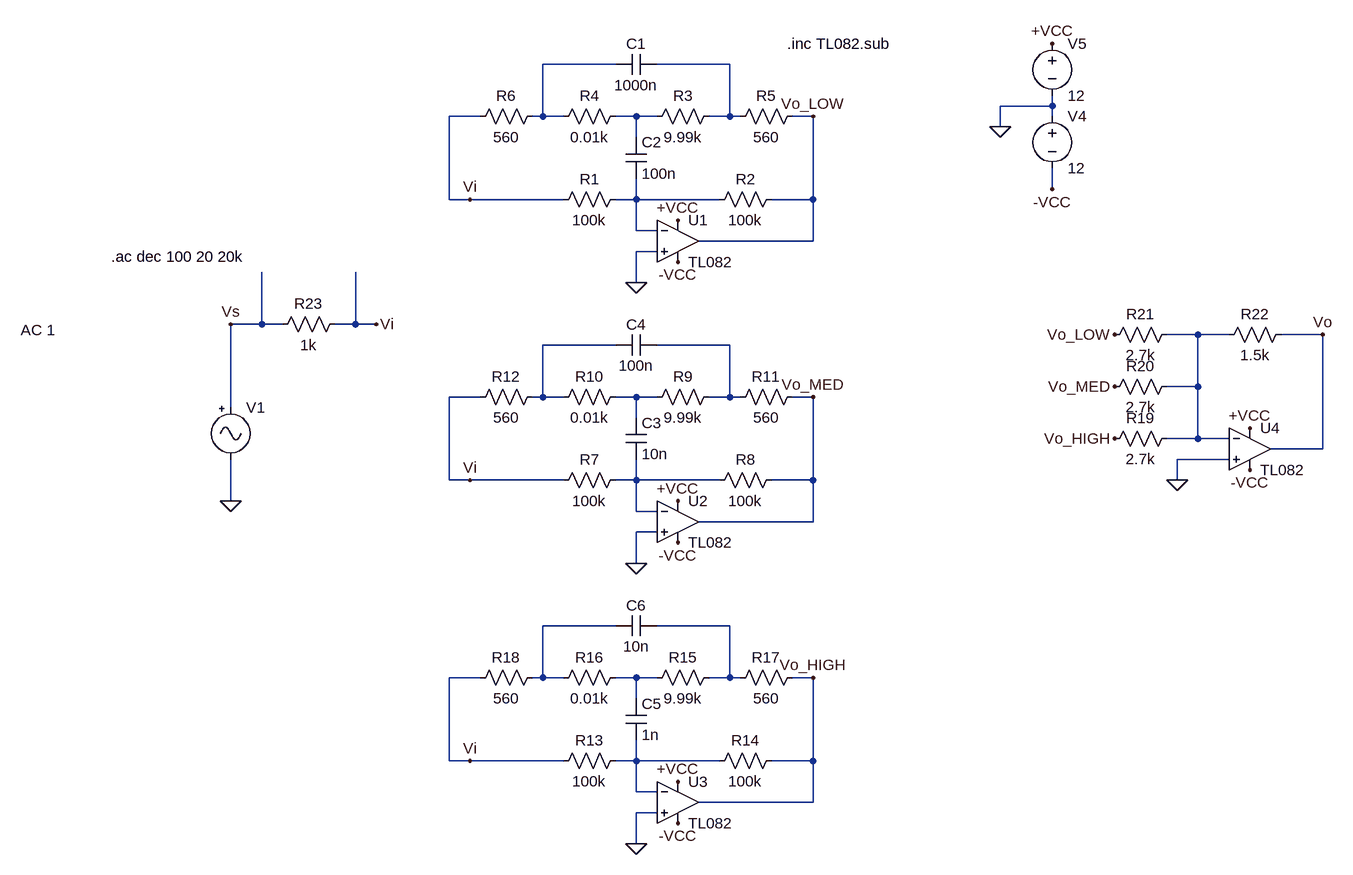
[diagram p0: schematic Ecualizador.asc]
Ecualizador.asc, the LTspice schematic file:
Version 4
SHEET 1 1656 1228
WIRE 80 -64 -32 -64
WIRE 256 -64 144 -64
WIRE 752 0 752 -16
WIRE 752 0 672 0
WIRE -128 16 -176 16
WIRE -32 16 -32 -64
WIRE -32 16 -48 16
WIRE 0 16 -32 16
WIRE 112 16 80 16
WIRE 144 16 112 16
WIRE 256 16 256 -64
WIRE 256 16 224 16
WIRE 272 16 256 16
WIRE 384 16 352 16
WIRE 752 16 752 0
WIRE 672 32 672 0
WIRE 112 48 112 16
WIRE 752 128 752 96
WIRE -176 144 -176 16
WIRE -144 144 -176 144
WIRE 0 144 -144 144
WIRE 112 144 112 112
WIRE 112 144 80 144
WIRE 240 144 112 144
WIRE 384 144 384 16
WIRE 384 144 320 144
WIRE 112 192 112 144
WIRE 144 192 112 192
WIRE 384 208 384 144
WIRE 384 208 208 208
WIRE 144 224 112 224
WIRE 112 272 112 224
WIRE -464 336 -464 256
WIRE -464 336 -512 336
WIRE -432 336 -464 336
WIRE -320 336 -320 256
WIRE -320 336 -352 336
WIRE -288 336 -320 336
WIRE 976 352 928 352
WIRE 1024 352 976 352
WIRE 1168 352 1104 352
WIRE 80 368 -32 368
WIRE 256 368 144 368
WIRE 976 432 976 352
WIRE 976 432 928 432
WIRE -128 448 -176 448
WIRE -32 448 -32 368
WIRE -32 448 -48 448
WIRE 0 448 -32 448
WIRE 112 448 80 448
WIRE 144 448 112 448
WIRE 256 448 256 368
WIRE 256 448 224 448
WIRE 272 448 256 448
WIRE 384 448 352 448
WIRE -512 464 -512 336
WIRE 112 480 112 448
WIRE 976 512 976 432
WIRE 976 512 928 512
WIRE 1024 512 976 512
WIRE 1168 528 1168 352
WIRE 1168 528 1088 528
WIRE 1024 544 944 544
WIRE -176 576 -176 448
WIRE -144 576 -176 576
WIRE 0 576 -144 576
WIRE 112 576 112 544
WIRE 112 576 80 576
WIRE 240 576 112 576
WIRE 384 576 384 448
WIRE 384 576 320 576
WIRE 944 576 944 544
WIRE -512 608 -512 544
WIRE 112 624 112 576
WIRE 144 624 112 624
WIRE 384 640 384 576
WIRE 384 640 208 640
WIRE 144 656 112 656
WIRE 112 704 112 656
WIRE 80 800 -32 800
WIRE 256 800 144 800
WIRE -128 880 -176 880
WIRE -32 880 -32 800
WIRE -32 880 -48 880
WIRE 0 880 -32 880
WIRE 112 880 80 880
WIRE 144 880 112 880
WIRE 256 880 256 800
WIRE 256 880 224 880
WIRE 272 880 256 880
WIRE 384 880 352 880
WIRE 112 912 112 880
WIRE -176 1008 -176 880
WIRE -144 1008 -176 1008
WIRE 0 1008 -144 1008
WIRE 112 1008 112 976
WIRE 112 1008 80 1008
WIRE 240 1008 112 1008
WIRE 384 1008 384 880
WIRE 384 1008 320 1008
WIRE 112 1056 112 1008
WIRE 144 1056 112 1056
WIRE 384 1072 384 1008
WIRE 384 1072 208 1072
WIRE 144 1088 112 1088
WIRE 112 1136 112 1088
FLAG 112 272 0
FLAG 112 704 0
FLAG 112 1136 0
FLAG 672 32 0
FLAG 752 -96 +VCC
FLAG 176 176 +VCC
FLAG 176 608 +VCC
FLAG 176 1040 +VCC
FLAG 752 128 -VCC
FLAG 176 240 -VCC
FLAG 176 672 -VCC
FLAG 176 1104 -VCC
FLAG 384 16 Vo_LOW
FLAG 384 448 Vo_MED
FLAG 384 880 Vo_HIGH
FLAG 1056 496 +VCC
FLAG 1056 560 -VCC
FLAG 848 352 Vo_LOW
FLAG 848 432 Vo_MED
FLAG 848 512 Vo_HIGH
FLAG 1168 352 Vo
FLAG 944 576 0
FLAG -512 608 0
FLAG -144 144 Vi
FLAG -144 576 Vi
FLAG -144 1008 Vi
FLAG -288 336 Vi
FLAG -512 336 Vs
SYMBOL res 96 128 R90
WINDOW 0 0 56 VBottom 2
WINDOW 3 32 56 VTop 2
SYMATTR InstName R1
SYMATTR Value 100k
SYMBOL res 336 128 R90
WINDOW 0 0 56 VBottom 2
WINDOW 3 32 56 VTop 2
SYMATTR InstName R2
SYMATTR Value 100k
SYMBOL cap 96 48 R0
SYMATTR InstName C2
SYMATTR Value 100n
SYMBOL res 240 0 R90
WINDOW 0 0 56 VBottom 2
WINDOW 3 32 56 VTop 2
SYMATTR InstName R3
SYMATTR Value 9.99k
SYMBOL res 96 0 R90
WINDOW 0 0 56 VBottom 2
WINDOW 3 32 56 VTop 2
SYMATTR InstName R4
SYMATTR Value 0.01k
SYMBOL res 368 0 R90
WINDOW 0 0 56 VBottom 2
WINDOW 3 32 56 VTop 2
SYMATTR InstName R5
SYMATTR Value 560
SYMBOL res -32 0 R90
WINDOW 0 0 56 VBottom 2
WINDOW 3 32 56 VTop 2
SYMATTR InstName R6
SYMATTR Value 560
SYMBOL Misc\\signal -512 448 R0
WINDOW 123 -323 -103 Left 2
WINDOW 39 0 0 Left 2
SYMATTR Value2 AC 1
SYMATTR InstName V1
SYMATTR Value ""
SYMBOL cap 144 -80 R90
WINDOW 0 0 32 VBottom 2
WINDOW 3 32 32 VTop 2
SYMATTR InstName C1
SYMATTR Value 1000n
SYMBOL res 96 560 R90
WINDOW 0 0 56 VBottom 2
WINDOW 3 32 56 VTop 2
SYMATTR InstName R7
SYMATTR Value 100k
SYMBOL res 336 560 R90
WINDOW 0 0 56 VBottom 2
WINDOW 3 32 56 VTop 2
SYMATTR InstName R8
SYMATTR Value 100k
SYMBOL cap 96 480 R0
SYMATTR InstName C3
SYMATTR Value 10n
SYMBOL res 240 432 R90
WINDOW 0 0 56 VBottom 2
WINDOW 3 32 56 VTop 2
SYMATTR InstName R9
SYMATTR Value 9.99k
SYMBOL res 96 432 R90
WINDOW 0 0 56 VBottom 2
WINDOW 3 32 56 VTop 2
SYMATTR InstName R10
SYMATTR Value 0.01k
SYMBOL res 368 432 R90
WINDOW 0 0 56 VBottom 2
WINDOW 3 32 56 VTop 2
SYMATTR InstName R11
SYMATTR Value 560
SYMBOL res -32 432 R90
WINDOW 0 0 56 VBottom 2
WINDOW 3 32 56 VTop 2
SYMATTR InstName R12
SYMATTR Value 560
SYMBOL cap 144 352 R90
WINDOW 0 0 32 VBottom 2
WINDOW 3 32 32 VTop 2
SYMATTR InstName C4
SYMATTR Value 100n
SYMBOL res 96 992 R90
WINDOW 0 0 56 VBottom 2
WINDOW 3 32 56 VTop 2
SYMATTR InstName R13
SYMATTR Value 100k
SYMBOL res 336 992 R90
WINDOW 0 0 56 VBottom 2
WINDOW 3 32 56 VTop 2
SYMATTR InstName R14
SYMATTR Value 100k
SYMBOL cap 96 912 R0
SYMATTR InstName C5
SYMATTR Value 1n
SYMBOL res 240 864 R90
WINDOW 0 0 56 VBottom 2
WINDOW 3 32 56 VTop 2
SYMATTR InstName R15
SYMATTR Value 9.99k
SYMBOL res 96 864 R90
WINDOW 0 0 56 VBottom 2
WINDOW 3 32 56 VTop 2
SYMATTR InstName R16
SYMATTR Value 0.01k
SYMBOL res 368 864 R90
WINDOW 0 0 56 VBottom 2
WINDOW 3 32 56 VTop 2
SYMATTR InstName R17
SYMATTR Value 560
SYMBOL res -32 864 R90
WINDOW 0 0 56 VBottom 2
WINDOW 3 32 56 VTop 2
SYMATTR InstName R18
SYMATTR Value 560
SYMBOL cap 144 784 R90
WINDOW 0 0 32 VBottom 2
WINDOW 3 32 32 VTop 2
SYMATTR InstName C6
SYMATTR Value 10n
SYMBOL Opamps\\opamp2 176 144 R0
SYMATTR InstName U1
SYMATTR Value TL082
SYMBOL Opamps\\opamp2 176 576 R0
SYMATTR InstName U2
SYMATTR Value TL082
SYMBOL Opamps\\opamp2 176 1008 R0
SYMATTR InstName U3
SYMATTR Value TL082
SYMBOL voltage 752 0 R0
WINDOW 123 0 0 Left 2
WINDOW 39 0 0 Left 2
SYMATTR InstName V4
SYMATTR Value 12
SYMBOL voltage 752 -112 R0
WINDOW 123 0 0 Left 2
WINDOW 39 0 0 Left 2
SYMATTR InstName V5
SYMATTR Value 12
SYMBOL Opamps\\opamp2 1056 464 R0
SYMATTR InstName U4
SYMATTR Value TL082
SYMBOL res 944 496 R90
WINDOW 0 0 56 VBottom 2
WINDOW 3 32 56 VTop 2
SYMATTR InstName R19
SYMATTR Value 2.7k
SYMBOL res 944 416 R90
WINDOW 0 0 56 VBottom 2
WINDOW 3 32 56 VTop 2
SYMATTR InstName R20
SYMATTR Value 2.7k
SYMBOL res 944 336 R90
WINDOW 0 0 56 VBottom 2
WINDOW 3 32 56 VTop 2
SYMATTR InstName R21
SYMATTR Value 2.7k
SYMBOL res 1120 336 R90
WINDOW 0 0 56 VBottom 2
WINDOW 3 32 56 VTop 2
SYMATTR InstName R22
SYMATTR Value 1.5k
SYMBOL res -336 320 R90
WINDOW 0 0 56 VBottom 2
WINDOW 3 32 56 VTop 2
SYMATTR InstName R23
SYMATTR Value 1k
TEXT 344 -96 Left 2 !.inc TL082.sub
TEXT -696 232 Left 2 !.ac dec 100 20 20k

The netlist it stands for:
* Ecualizador.asc
R1 N004 Vi 100k
R2 Vo_LOW N004 100k
C2 N003 N004 100n
R3 N002 N003 9.99k
R4 N003 N001 0.01k
R5 Vo_LOW N002 560
R6 N001 Vi 560
V1 Vs 0 AC 1
C1 N002 N001 1000n
R7 N009 Vi 100k
R8 Vo_MED N009 100k
C3 N008 N009 10n
R9 N007 N008 9.99k
R10 N008 N006 0.01k
R11 Vo_MED N007 560
R12 N006 Vi 560
C4 N007 N006 100n
R13 N013 Vi 100k
R14 Vo_HIGH N013 100k
C5 N012 N013 1n
R15 N011 N012 9.99k
R16 N012 N010 0.01k
R17 Vo_HIGH N011 560
R18 N010 Vi 560
C6 N011 N010 10n
XU1 0 N004 +VCC -VCC Vo_LOW TL082  ; pins In+ In- V+ V- OUT
XU2 0 N009 +VCC -VCC Vo_MED TL082  ; pins In+ In- V+ V- OUT
XU3 0 N013 +VCC -VCC Vo_HIGH TL082  ; pins In+ In- V+ V- OUT
V4 0 -VCC 12
V5 +VCC 0 12
XU4 0 N005 +VCC -VCC Vo TL082  ; pins In+ In- V+ V- OUT
R19 N005 Vo_HIGH 2.7k
R20 N005 Vo_MED 2.7k
R21 N005 Vo_LOW 2.7k
R22 Vo N005 1.5k
R23 Vi Vs 1k
.inc TL082.sub
.ac dec 100 20 20k
.backanno
.end